# Altium schematic sheet powah.SchDoc
size A; SheetNumber: 3; SheetTotal: 7
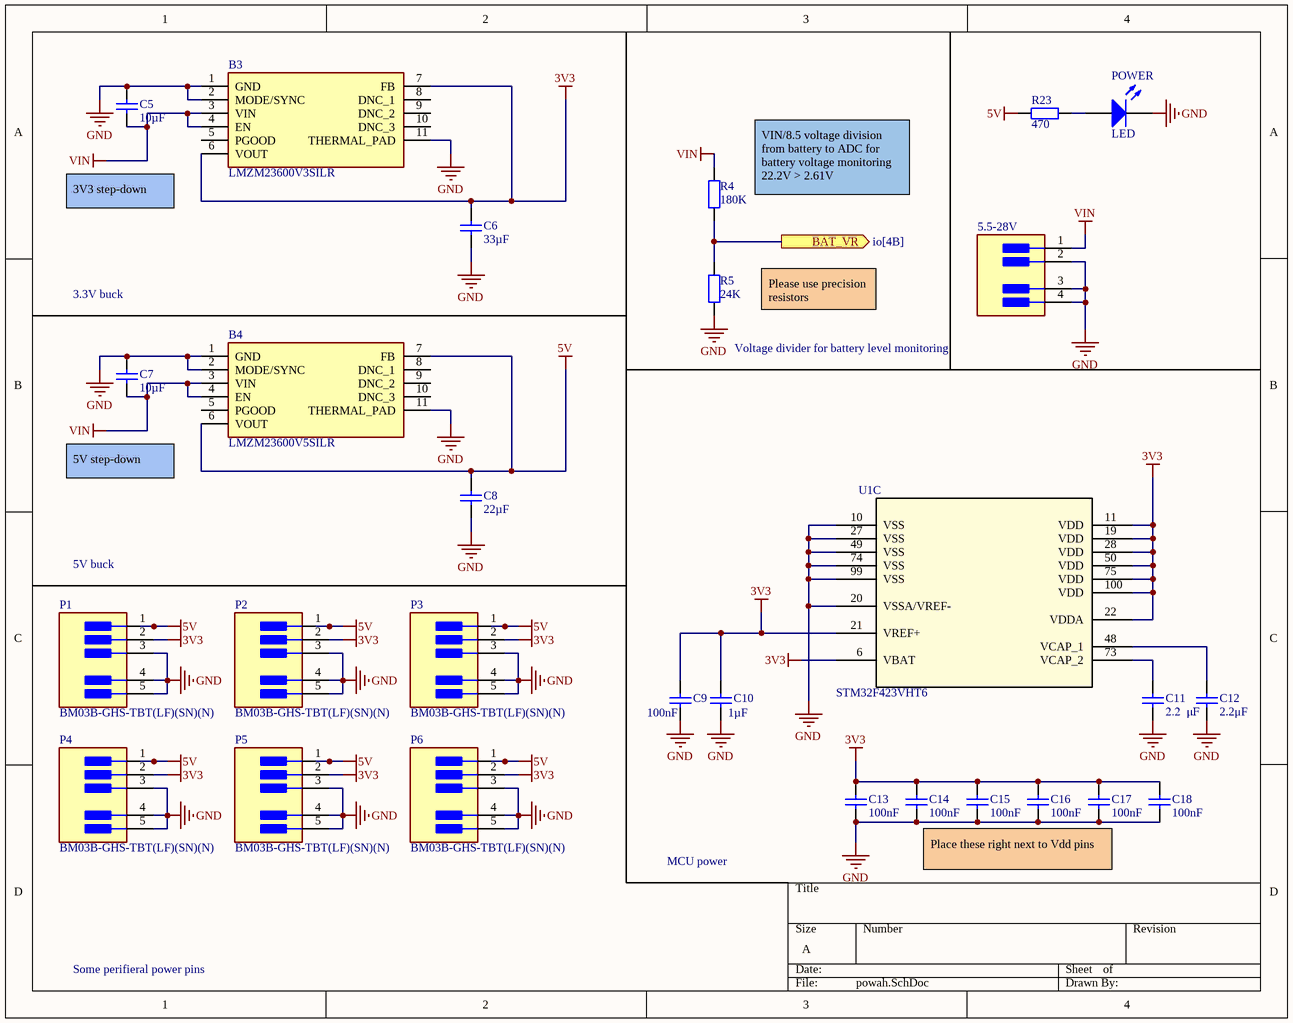
[diagram p0: powah.SchDoc]

## Parts
5.5-28V  (no value)  [FP-SM02B-GHS-TB_LF_SN-MFG]
B3  LMZM23600V3SILR  [LMZM23601V5SILR]
B4  LMZM23600V5SILR  [LMZM23601V5SILR]
C5  10µF  [FP_0805_CAP_085]
C6  33µF  [FP_0805_CAP_085]
C7  10µF  [FP_0805_CAP_085]
C8  22µF  [FP_0805_CAP_085]
C9  100nF  [FP_0805_CAP_085]
C10  1µF  [FP_0805_CAP_085]
C11  2.2μF  [FP_0805_CAP_085]
C12  2.2μF  [FP_0805_CAP_085]
C13  100nF  [FP_0805_CAP_085]
C14  100nF  [FP_0805_CAP_085]
C15  100nF  [FP_0805_CAP_085]
C16  100nF  [FP_0805_CAP_085]
C17  100nF  [FP_0805_CAP_085]
C18  100nF  [FP_0805_CAP_085]
P1  BM03B-GHS-TBT(LF)(SN)(N)  [FP-SM03B-GHS-TB_LF_SN-MFG]
P2  BM03B-GHS-TBT(LF)(SN)(N)  [FP-SM03B-GHS-TB_LF_SN-MFG]
P3  BM03B-GHS-TBT(LF)(SN)(N)  [FP-SM03B-GHS-TB_LF_SN-MFG]
P4  BM03B-GHS-TBT(LF)(SN)(N)  [FP-SM03B-GHS-TB_LF_SN-MFG]
P5  BM03B-GHS-TBT(LF)(SN)(N)  [FP-SM03B-GHS-TB_LF_SN-MFG]
P6  BM03B-GHS-TBT(LF)(SN)(N)  [FP-SM03B-GHS-TB_LF_SN-MFG]
POWER  LED  [FP_0805_LED_GREEN]
R4  180K  [FP_0805_RES]
R5  24K  [FP_0805_RES]
R23  470  [FP_0805_RES]
U1  STM32F423VHT6  [LQFP100-14x14mm]  (part C of 3)

## Ports
BAT_VR (out, see io[4B])

## Nets
3V3: B3.6(VOUT) B3.7(FB) C6.2 C9.2 C10.2 C13.2 C14.2 C15.2 C16.2 C17.2 C18.2 P1.2 P2.2 P3.2 P4.2 P5.2 P6.2 U1.6(VBAT) U1.11(VDD) U1.19(VDD) U1.21(VREF+) U1.22(VDDA) U1.28(VDD) U1.50(VDD) U1.75(VDD) U1.100(VDD)
5V: B4.6(VOUT) B4.7(FB) C8.2 P1.1 P2.1 P3.1 P4.1 P5.1 P6.1 R23.1
GND: 5.5-28V.2 5.5-28V.3(MNT_1) 5.5-28V.4(MNT_2) B3.1(GND) B3.2(MODE/SYNC) B3.11(THERMAL_PAD) B4.1(GND) B4.2(MODE/SYNC) B4.11(THERMAL_PAD) C5.2 C6.1 C7.2 C8.1 C9.1 C10.1 C11.1 C12.1 C13.1 C14.1 C15.1 C16.1 C17.1 C18.1 P1.3 P1.4(MNT_1) P1.5(MNT_2) P2.3 P2.4(MNT_1) P2.5(MNT_2) P3.3 P3.4(MNT_1) P3.5(MNT_2) P4.3 P4.4(MNT_1) P4.5(MNT_2) P5.3 P5.4(MNT_1) P5.5(MNT_2) P6.3 P6.4(MNT_1) P6.5(MNT_2) POWER.2(K) R5.1 U1.10(VSS) U1.20(VSSA/VREF-) U1.27(VSS) U1.49(VSS) U1.74(VSS) U1.99(VSS)
VIN: 5.5-28V.1 B3.3(VIN) B3.4(EN) B4.3(VIN) B4.4(EN) C5.1 C7.1 R4.2
BAT_VR: R4.1 R5.2 ; port BAT_VR
NetC11_2: C11.2 U1.73(VCAP_2)
NetC12_2: C12.2 U1.48(VCAP_1)
NetPOWER_1: POWER.1(A) R23.2

Not connected (* = marked no-connect by the designer): B3 5(PGOOD) 8(DNC_1) 9(DNC_2) 10(DNC_3); B4 5(PGOOD) 8(DNC_1) 9(DNC_2) 10(DNC_3)

## Notes on the sheet
- 3V3 step-down
- (near R4) VIN/8.5 voltage division from battery to ADC for battery voltage monitoring    22.2V > 2.61V
- 3.3V buck
- Voltage divider for battery level monitoring
- (near R5) Please use precision resistors
- 5V step-down
- 5V buck
- MCU power
- Place these right next to Vdd pins
- Some perifieral power pins

## Library data of the parts
5.5-28V = CMP-2000-05957-2: 2p; Pitch: 0.049inch; Connector Type: Outer Shroud Contact; Number of Positions: 2; Packaging: Tape and Reel; Lead Free: Lead Free; Termination: Solder; Fastening Type: Ramp; Number of Rows: 1; Color: Natural; Contact Plating: Tin; Mount: Surface Mount
B3 = LMZM23600V3SILR: 36-V, 0.5-A Step-Down DC/DC Power Module in 3.8-mm  3-mm Package; Manufacturer_Name: Texas Instruments; Geometry.Height: 1.578mm; Mouser Part Number: 595-LMZM23600V3SILR; Mouser Price/Stock: https://www.mouser.co.uk/ProductDetail/Texas-Instruments/LMZM23600V3SILR?qs=55YtniHzbhDJv8FpBtYOcw%3D%3D; Manufacturer_Part_Number: LMZM23600V3SILR; Datasheet Link: http://www.ti.com/lit/gpn/lmzm23600
B4 = LMZM23600V5SILR: 36-V, 0.5-A Step-Down DC/DC Power Module in 3.8-mm  3-mm Package; Manufacturer_Name: Texas Instruments; Geometry.Height: 1mm; Mouser Part Number: 595-LMZM23600V5SILR; Mouser Price/Stock: https://www.mouser.co.uk/ProductDetail/Texas-Instruments/LMZM23600V5SILR?qs=55YtniHzbhCRfZgYPiZvxw%3D%3D; Manufacturer_Part_Number: LMZM23600V5SILR; Datasheet Link: http://www.ti.com/lit/gpn/lmzm23600
C5-C18 = CAP: Capacitor
  C5 C7: Value: 10µF
  C6: Value: 33µF
  C8: Value: 22µF
  C9 C13-C18: Value: 100nF
  C10: Value: 1µF
  C12: Value: 2.2μF
P1-P6 = CMP-17439-000058-1: 3p; Pitch: 0.049inch; Number of Positions: 3; Connector Type: Header; Contact Finish - Mating: TIN; Lead Free: Lead Free; Series: GH; Fastening Type: Ramp; Number of Rows: 1; Insulation Color: Natural; Contact Material: Bronze; Insulation Material: Nylon; Min Operating Temperature: -25°C; Contact Type: Outer Shroud Contact; Max Operating Temperature: 85°C; Termination: Solder; Flammability Rating: UL94 V-0; Color: Natural; Contact Plating: Tin; Contact Shape: Rectangular; Mount: Surface Mount; Packaging: Cut Tape
POWER = LED: Typical RED GaAs LED; pin to pad: 1>A 2>K; Supplier: lomex; Verified: false
R4 R5 R23 = RES: Resistor
  R4: Value: 180K
  R5: Value: 24K
  R23: Value: 470
U1 = STM32F423VHT6: No Description Available; Mfr_Name: STMicroelectronics; RefDes: RefDes; Type: Type